# Altium schematic sheet main_pwr.SchDoc: SDL - Main
size Letter; Author: Ye-Sheng Kuo; Revision: 1; SheetNumber: 2; SheetTotal: 8
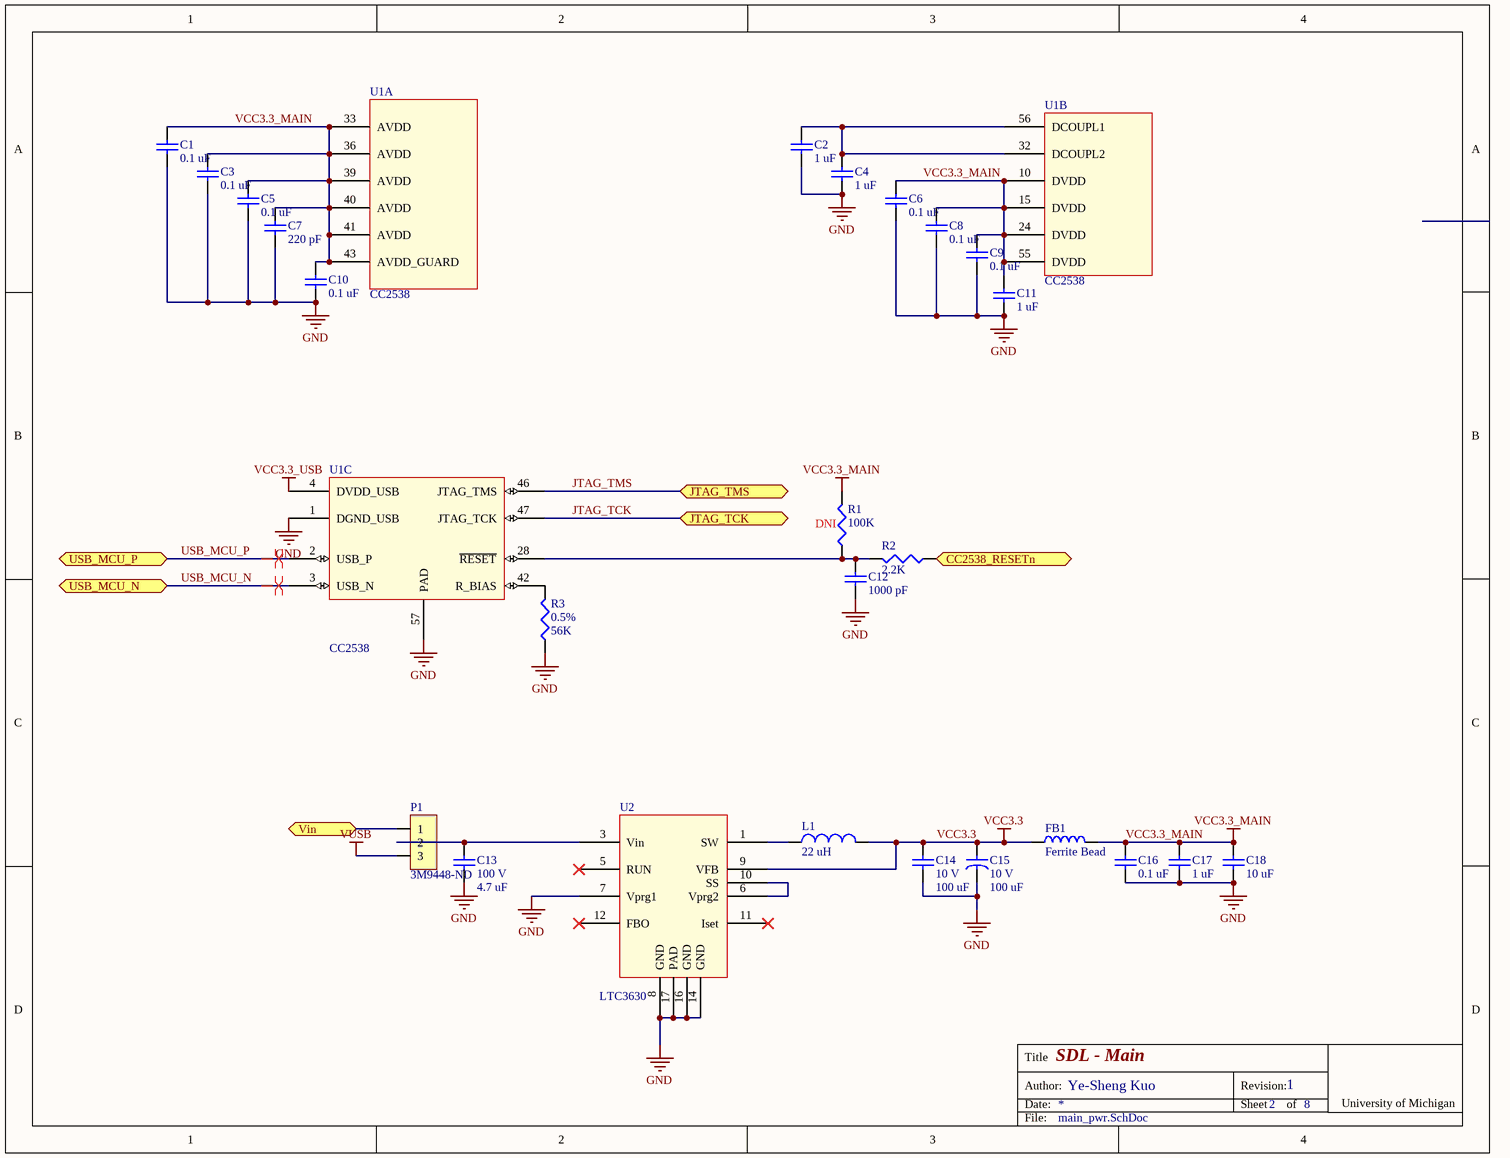
[diagram p0: main_pwr.SchDoc]

## Parts
C1  value 0.1 uF  [0402]  (hidden comment: Ceramic capacitor)
C2  value 1 uF  [0402]  (hidden comment: Ceramic capacitor)
C3  value 0.1 uF  [0402]  (hidden comment: Ceramic capacitor)
C4  value 1 uF  [0402]  (hidden comment: Ceramic capacitor)
C5  value 0.1 uF  [0402]  (hidden comment: Ceramic capacitor)
C6  value 0.1 uF  [0402]  (hidden comment: Ceramic capacitor)
C7  value 220 pF  [0402]  (hidden comment: Ceramic capacitor)
C8  value 0.1 uF  [0402]  (hidden comment: Ceramic capacitor)
C9  value 0.1 uF  [0402]  (hidden comment: Ceramic capacitor)
C10  value 0.1 uF  [0402]  (hidden comment: Ceramic capacitor)
C11  value 1 uF  [0402]  (hidden comment: Ceramic capacitor)
C12  value 1000 pF  [0402]  (hidden comment: Ceramic capacitor)
C13  value 4.7 uF  voltage rated: 100 V  [2220]  (hidden comment: Ceramic capacitor)
C14  value 100 uF  voltage rated: 10 V  [1210]  (hidden comment: Ceramic capacitor)
C15  value 100 uF  voltage rated: 10 V  [2917]  (hidden comment: Ceramic capacitor)
C16  value 0.1 uF  [0402]  (hidden comment: Ceramic capacitor)
C17  value 1 uF  [0402]  (hidden comment: Ceramic capacitor)
C18  value 10 uF  [0603]  (hidden comment: Ceramic capacitor)
FB1  Ferrite Bead  [0402]
L1  value 22 uH  [SLF10145]  (hidden comment: L_22uH_SLF10145)
P1  Supplier Part Number 1: 3M9448-ND  [1x3 header]  (hidden comment: 1 x 3 header)
R1  value 100K  [0402]  (hidden comment: Chip resistor)
R2  value 2.2K  [0402]  (hidden comment: Chip resistor)
R3  value 56K  tolerance: 0.5%  [0402]  (hidden comment: Chip resistor)
U1  CC2538  [QFN56]  (parts A,B,C of 6)
U2  LTC3630  [MSE16(12)]

## Ports
CC2538_RESETn, JTAG_TCK, JTAG_TMS, USB_MCU_N, USB_MCU_P, Vin

## Nets
GND: C1.2 C2.2 C3.2 C4.2 C5.2 C6.2 C7.2 C8.2 C9.2 C10.2 C11.2 C12.2 C13.2 C14.2 C15.2 C16.2 C17.2 C18.2 R3.2 U1.1(DGND_USB) U1.57(PAD) U2.7(Vprg1) U2.8(GND) U2.14(GND) U2.16(GND) U2.17(PAD)
VCC3.3: C14.1 C15.1 FB1.2 L1.1 U2.9(VFB)
VCC3.3_MAIN: C1.1 C3.1 C5.1 C6.1 C7.1 C8.1 C9.1 C10.1 C11.1 C16.1 C17.1 C18.1 FB1.1 R1.1 U1.10(DVDD) U1.15(DVDD) U1.24(DVDD) U1.33(AVDD) U1.36(AVDD) U1.39(AVDD) U1.40(AVDD) U1.41(AVDD) U1.43(AVDD_GUARD) U1.55(DVDD)
VCC3.3_USB: U1.4(DVDD_USB)
VUSB: P1.3
CC2538_RESETn: R2.2 ; port CC2538_RESETn
JTAG_TCK: U1.47(JTAG_TCK) ; port JTAG_TCK
JTAG_TMS: U1.46(JTAG_TMS) ; port JTAG_TMS
USB_MCU_N: U1.3(USB_N) ; port USB_MCU_N
USB_MCU_P: U1.2(USB_P) ; port USB_MCU_P
Vin: P1.1 ; port Vin
NetC2_1: C2.1 C4.1 U1.32(DCOUPL2) U1.56(DCOUPL1)
NetC12_1: C12.1 R1.2 R2.1 U1.28(~{RESET})
NetC13_1: C13.1 P1.2 U2.3(Vin)
NetL1_2: L1.2 U2.1(SW)
NetR3_1: R3.1 U1.42(R_BIAS)
NetU2_6: U2.6(Vprg2) U2.10(SS)

Not connected (* = marked no-connect by the designer): U2 5(RUN)* 11(Iset)* 12(FBO)*

## Layout directives
differential pair: USB_MCU_N, USB_MCU_P

## Notes on the sheet
- (near R1) DNI
- Title
- Date:
- Author:
- Revision:
- Sheet
- of
- University of Michigan
- File:

## Library data of the parts
C1 C3 C5 C6 C8-C10 C16 = C_0.1u_0402_ceramic: Ceramic capacitor, 0.1u, 0402 package; Manufacture: TDK; voltage rated: 10 V; tolerance: 10%; Supplier 1: Digi-Key; Supplier Part Number 1: 445-1265-1-ND; package: 0402
C2 C4 C11 C17 = C_1u_0402_ceramic: Ceramic capacitor, 1 uF, 0402 package; Manufacture: TDK; voltage rated: 6.3 V; tolerance: 10%; package: 0402; Supplier 1: Digi-Key; Supplier Part Number 1: 445-5000-1-ND
C7 = C_220p_0402_ceramic: Ceramic capacitor, 220 pF, 0402 package; Manufacture: Johanson; voltage rated: 50 V; tolerance: 10%; package: 0402; Temperature: X7R; Supplier 1: Digi-Key; Supplier Part Number 1: 445-1254-1-ND
C12 = C_1000p_0402_ceramic: Ceramic capacitor, 1000 pF, 0402 package; Manufacture: TDK; voltage rated: 50 V; tolerance: 10%; package: 0402; Supplier 1: Digi-Key; Supplier Part Number 1: 445-6846-1-ND
C13 = C_4.7u_2220_ceramic: Ceramic capacitor, 4.7u, 2220 package; Manufacture: TDK; tolerance: 20%; Temp rating: X7R; package: 2220; Supplier 1: Digi-Key; Supplier Part Number 1: 445-1450-1-ND
C14 = C_100u_1210_ceramic: Ceramic capacitor, 100u, 1210 package; Manufacture: Samsung; tolerance: 20%; package: 2917; Supplier 1: Digi-Key; Supplier Part Number 1: 1276-3364-1-ND
C15 = C_100u_2917_tantalum: Tantalum capacitor, 100u, 2917 package; Manufacture: Kemet; tolerance: 10%; package: 2917; Supplier 1: Digi-Key; Supplier Part Number 1: 399-3769-1-ND
C18 = C_10u_0603_ceramic: Ceramic capacitor, 10 uF, 0603 package; Manufacture: TDK; voltage rated: 6.3V; tolerance: 20%; package: 0603; Supplier 1: Digi-Key; Supplier Part Number 1: 445-4112-1-ND
FB1 = FB_150mA_0402: Ferrite Bead, 150 mA, 0402 package; impedance@Freq: 1K@100 MHz; current rating: 150 mA; Supplier 1: Digi-Key; Supplier Part Number 1: 587-1835-1-ND; package: 0402
L1 = L_22uH_SLF10145: Inductor, 22 uH, TDK SLF10145; Saturation current: 2.1 A; Supplier 1: Digi-Key; Supplier Part Number 1: 445-1981-1-ND
P1 = 1 x 3 header: 100 mils standard header; Supplier 1: Digi-Key
R1 = R_100K_0402: Chip resistor, 100K, 0402 package; tolerance: 1%; power: 1/16 W; Supplier 1: Digi-Key; Supplier Part Number 1: 541-100KLCT-ND; package: 0402
R2 = R_2.2K_0402: Chip resistor, 2.2K, 0402 package; tolerance: 1%; power: 1/16 W; package: 0402; Supplier 1: Digi-Key; Supplier Part Number 1: 541-2.20KLCT-ND
R3 = R_56K_0402: Chip resistor, 56K, 0402 package; power: 1/16 W; Temperature coefficient: 25 ppm/C; package: 0402; Supplier 1: Digi-Key; Supplier Part Number 1: P56KDECT-ND
U1 = CC2538: A Powerful System-On-Chip for 2.4-GHz IEEE 802.15.4, 6LoWPAN  and ZigBee Applications; Supplier 1: Digi-Key; Supplier Part Number 1: 296-35797-1-ND
U2 = LTC3630: High Efficiency, 65V 500mA synchronous Step-Down Converter; Supplier 1: Digi-Key; Supplier Part Number 1: LTC3630EMSE#PBF-ND